# EAGLE board Motherboard Schematics - 1 - 29_Dec_2020 (EAGLE 9.6.2), part 1 of 2
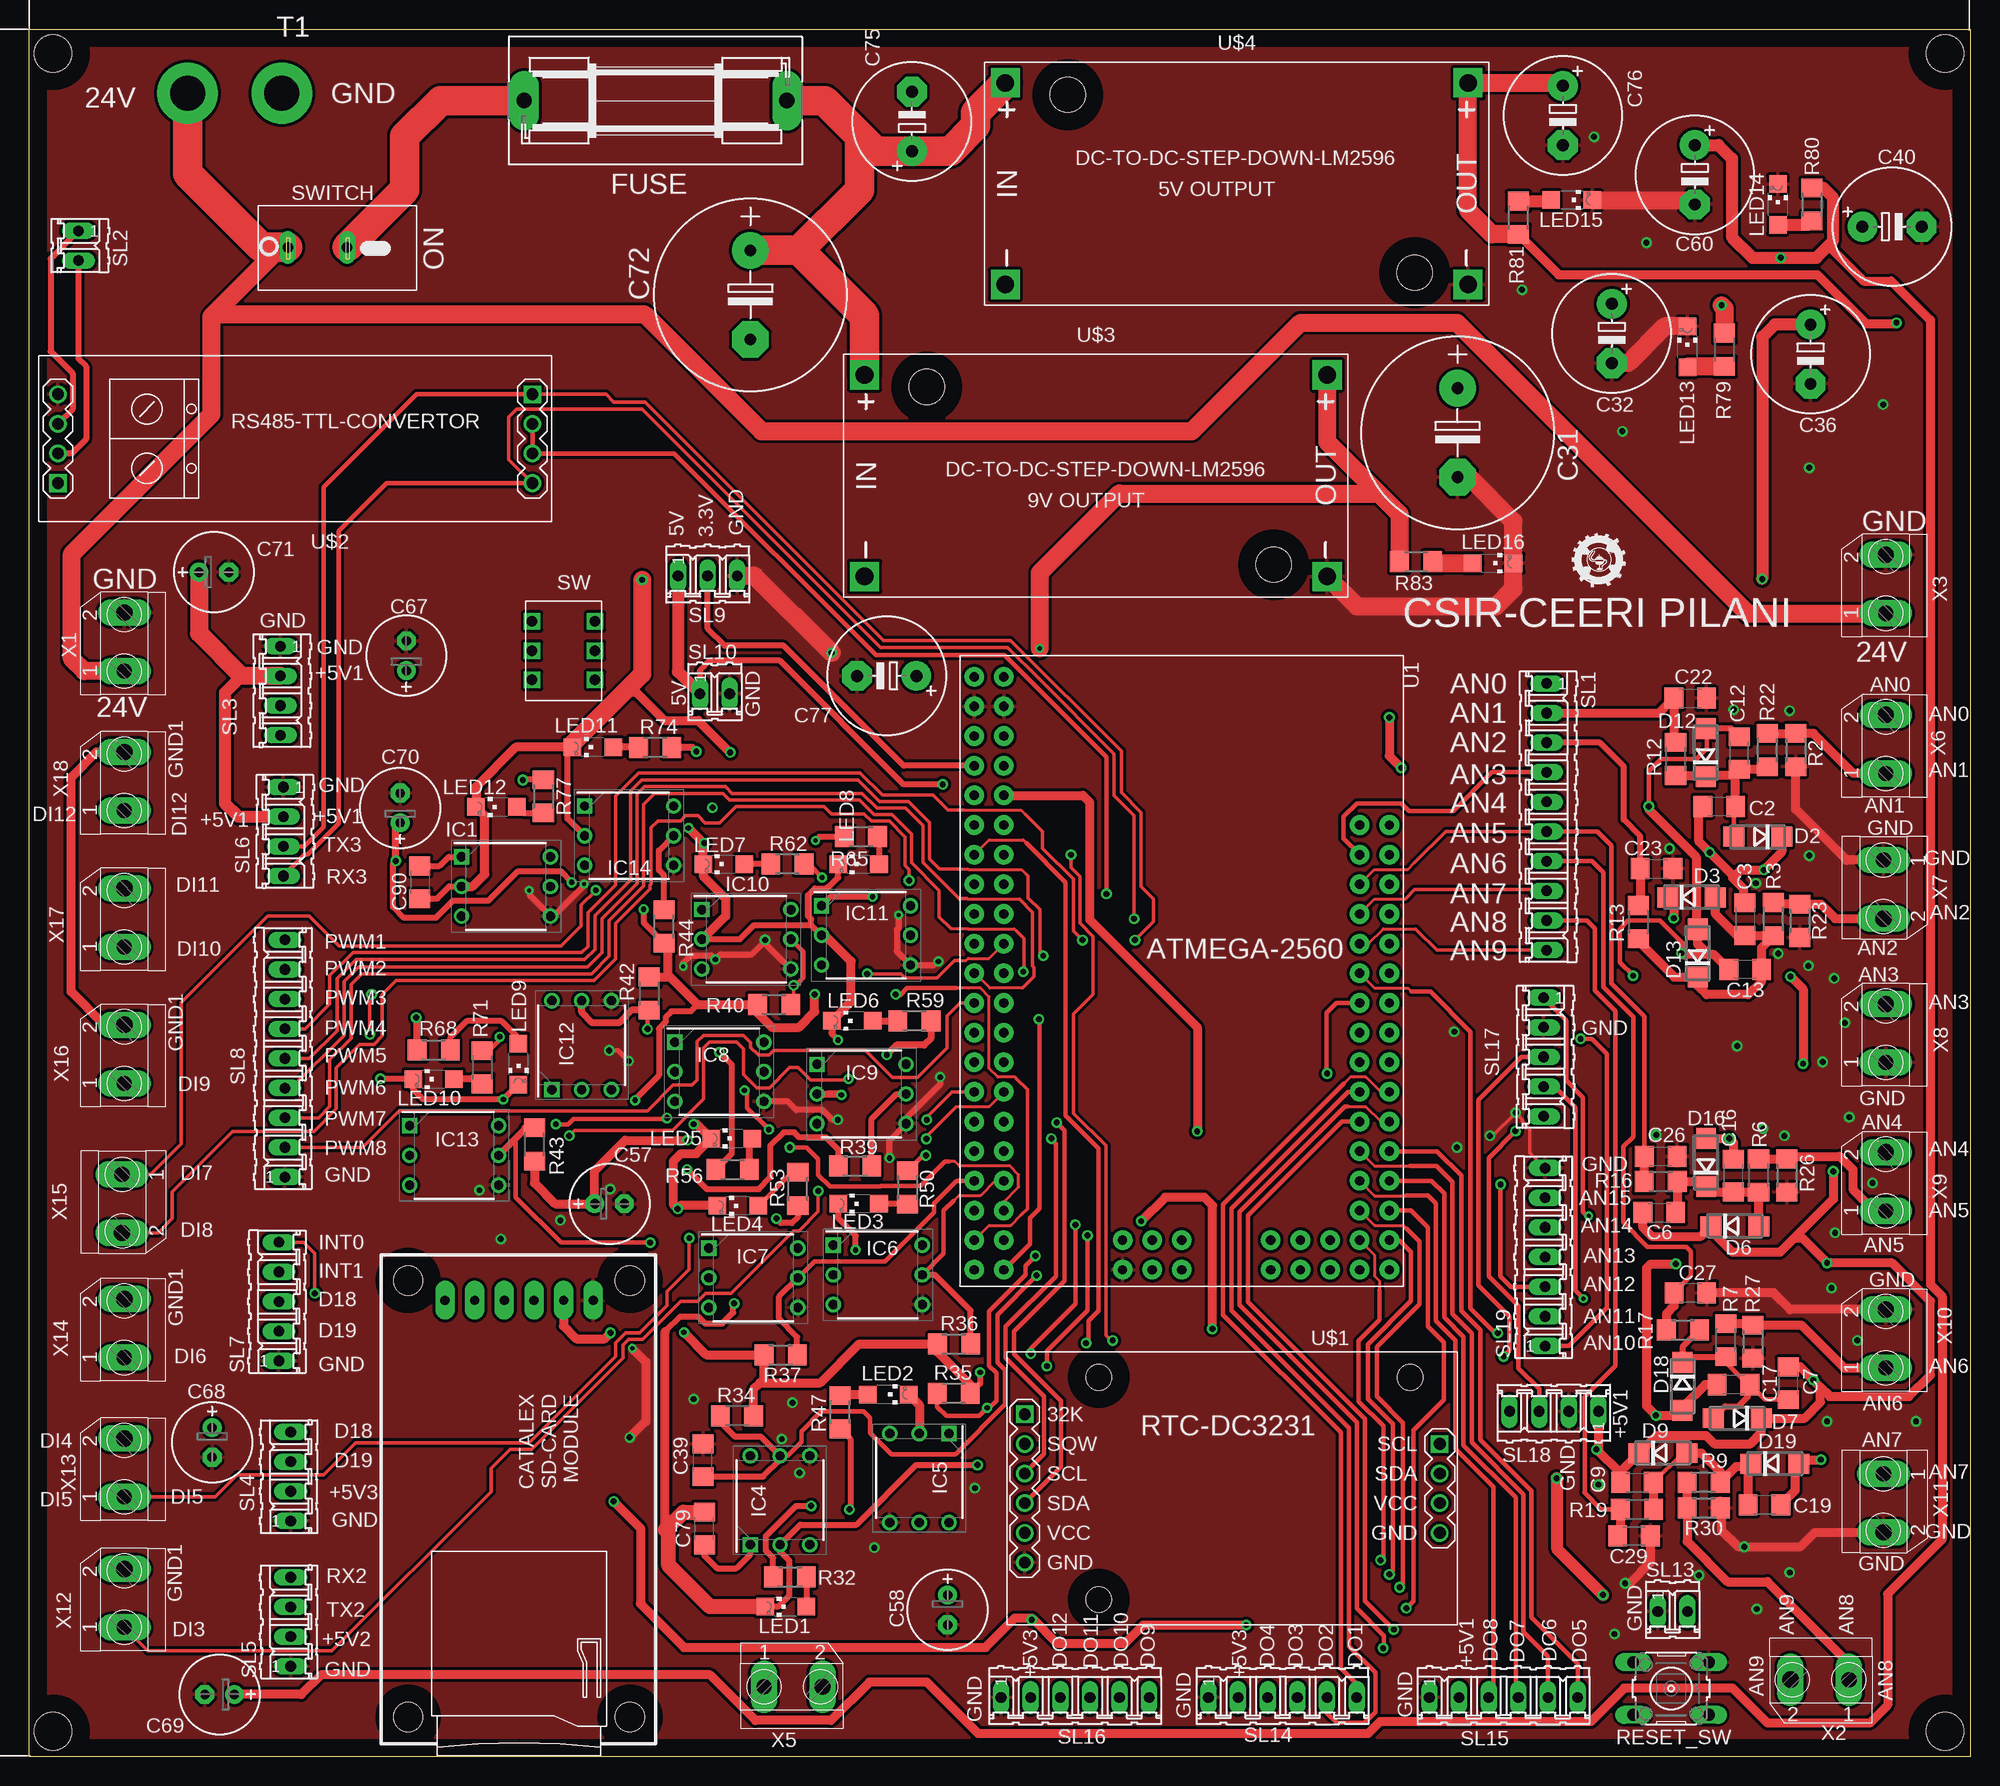
[diagram p3: board, top side]
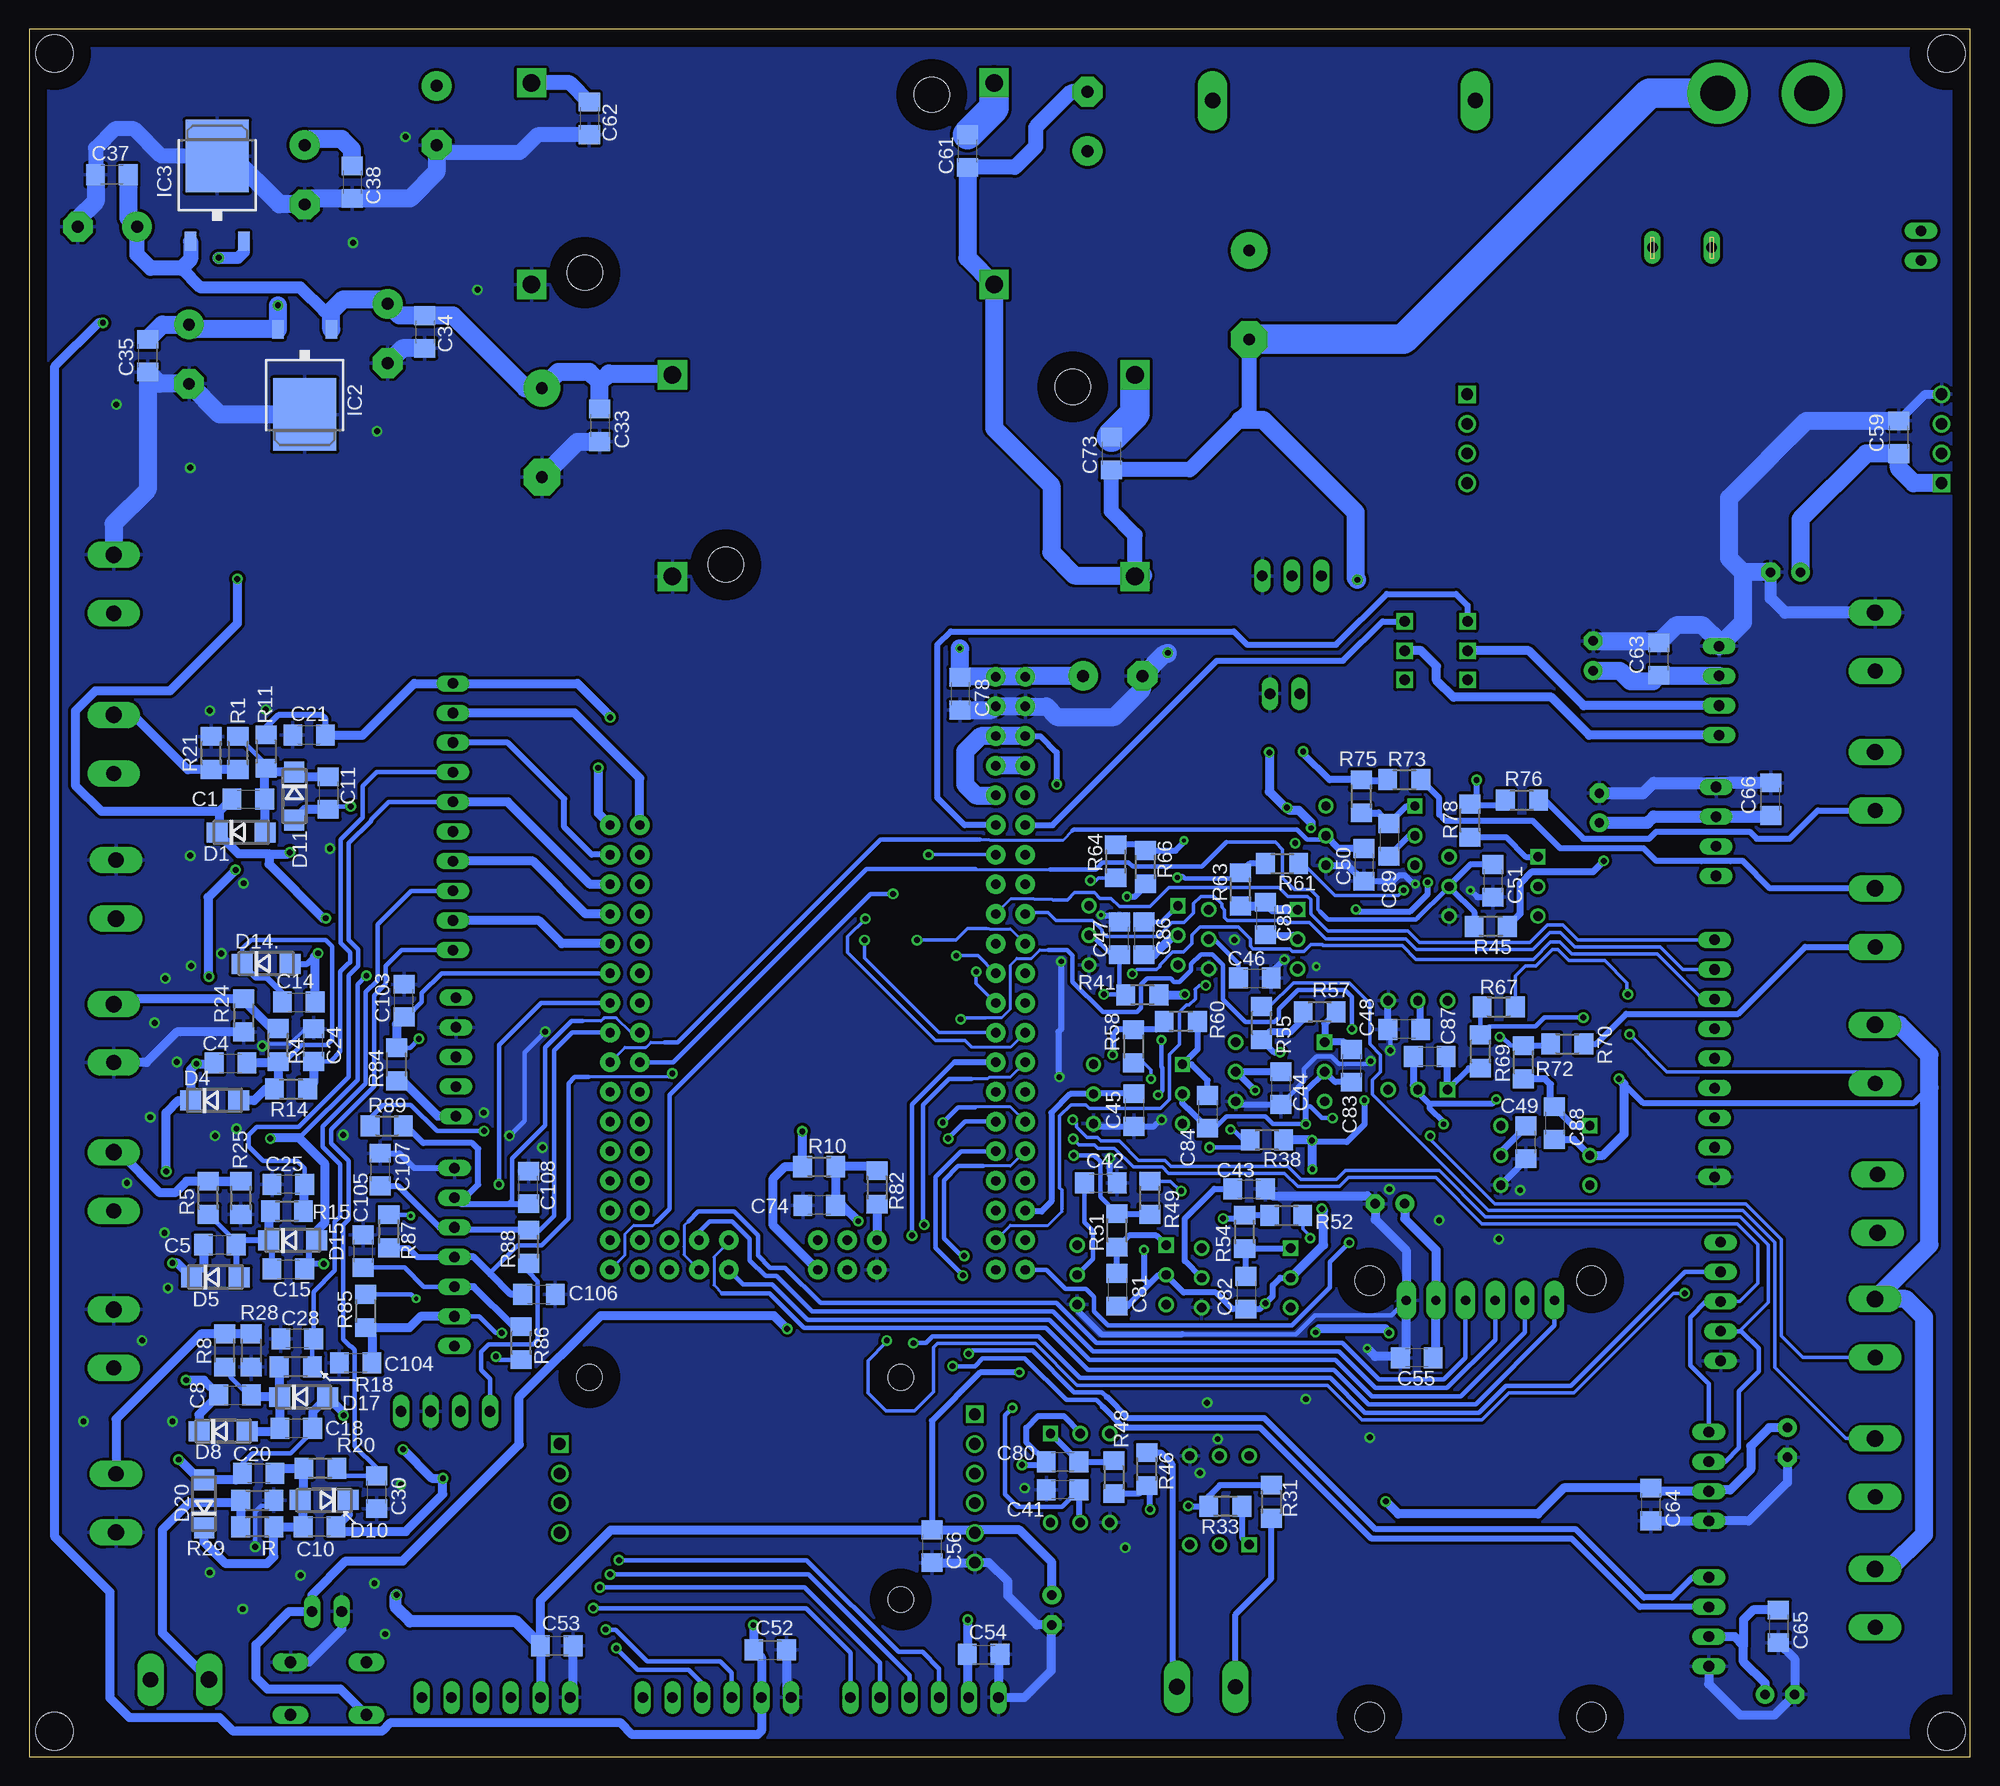
[diagram p4: board, bottom side, seen from below]

Size 166.27 x 147.98 mm. Coordinates in mm from the lower left corner, seen from the top.
Outline: 0,147.98 166.27,147.98 166.27,0 0,0 0,147.98
Copper layers (1*16): Top 0.035mm / dielectric 1.5mm / Bottom 0.035mm
Design rules "default *": minimum track width 6mil, minimum drill 0.35mm, track to track 10mil, track to pad 10mil, pad to pad 10mil, via to via 10mil, smd to smd 10mil, copper to edge 60mil, drill to drill 6mil, minimum pad ring 10mil, minimum via ring 8mil, stop-mask expansion 4mil, vias tented up to drill 22mil, thermal gap 10mil
Holes 3.2 mm at 164.11,145.9 164.11,2.18 2.06,2.18 2.06,145.9

## Footprints (pad centres in the part's own frame; a part is rotated, then mirrored left to right if it is on the bottom)
C1206 = smd 1.6 x 1.8: 1 -1.4,0; 2 1.4,0
E7,5-16 = drill 1.016 pad 3.15: + -3.81,0 | drill 1.016 pad 3.15 octagon: - 3.81,0
E5-10,5 = drill 1.016 pad 2.54: + -2.54,0 | drill 1.016 pad 2.54 octagon: - 2.54,0
E2,5-7 = drill 0.813 pad 1.6: + -1.27,0 | drill 0.813 pad 1.6 octagon: - 1.27,0
DO214AC = smd 1.8 x 1.7: A 2.05,0; C -2.05,0
SH22,5A = drill 1.321 pad 2.54 long: 1 -11.252,0; 2 11.252,0
DIP762W60P254L712H480Q6N = drill 0.8 pad 1.2 square: 1 -3.81,2.54 | drill 0.8 pad 1.2: 2 -3.81,0; 3 -3.81,-2.54; 4 3.81,-2.54; 5 3.81,0; 6 3.81,2.54
TO252 = smd 1 x 1.6: 1 -2.28,-4.8; 2 2.28,-4.8 | smd 5.4 x 6.2: 3 0,2.5
CHIPLED_1206 = smd 1.5 x 1.5: A 0,-1.75; C 0,1.75
CARD-SD-ADAPTER-CATALEX = drill 0.8 pad 1.676 long: CS -17,-6.35; GND -17,6.35; MISO -17,1.27; MOSI -17,-1.27; SCK -17,-3.81; VCC5V -17,3.81 | hole 2.5: -18.7,9.5; 18.7,9.5; 18.7,-9.5; -18.7,-9.5
R1206 = smd 1.6 x 1.803: 1 -1.422,0; 2 1.422,0
B3F-10XX = drill 1.016 long: 1 -3.251,2.261; 2 3.251,2.261; 3 -3.251,-2.261; 4 3.251,-2.261
10P = drill 0.914 long: 1 -11.43,0; 2 -8.89,0; 3 -6.35,0; 4 -3.81,0; 5 -1.27,0; 6 1.27,0; 7 3.81,0; 8 6.35,0; 9 8.89,0; 10 11.43,0
02P = drill 0.914 long: 1 -1.27,0; 2 1.27,0
04P = drill 0.914 long: 1 -3.81,0; 2 -1.27,0; 3 1.27,0; 4 3.81,0
05P = drill 0.914 long: 1 -5.08,0; 2 -2.54,0; 3 0,0; 4 2.54,0; 5 5.08,0
09P = drill 0.914 long: 1 -10.16,0; 2 -7.62,0; 3 -5.08,0; 4 -2.54,0; 5 0,0; 6 2.54,0; 7 5.08,0; 8 7.62,0; 9 10.16,0
03P = drill 0.914 long: 1 -2.54,0; 2 0,0; 3 2.54,0
06P = drill 0.914 long: 1 -6.35,0; 2 -3.81,0; 3 -1.27,0; 4 1.27,0; 5 3.81,0; 6 6.35,0
07P = drill 0.914 long: 1 -7.62,0; 2 -5.08,0; 3 -2.54,0; 4 0,0; 5 2.54,0; 6 5.08,0; 7 7.62,0
SPPH410100 = drill 0.9 square: 1 2.7,-2.5; 2 2.7,0; 3 2.7,2.5; 4 -2.7,-2.5; 5 -2.7,0; 6 -2.7,2.5
SWITCH_I = drill 0.9 long: P$1 5.08,0; P$3 0,0
BOC_TERMINAL = drill 3 pad 5.2: P$1 0,0; P$2 8.08,0
MODULE_MEGA_PRO_EMBED_CH340G_/_ATMEGA2560 = drill 0.8 pad 1.676: 3V3_1 -17.58,-17.78; 3V3_2 -17.58,-15.24; 5V_1 -20.12,-17.78; 5V_2 -20.12,-15.24; 5V_3 25.6,0; A0 -12.5,17.78; A1 -12.5,15.24; A2 -9.96,17.78; A3 -9.96,15.24; A4 -7.42,17.78; A5 -7.42,15.24; A6 -4.88,17.78; A7 -4.88,15.24; A8 -2.34,17.78; A9 -2.34,15.24; A10 0.2,17.78; A11 0.2,15.24; A12 2.74,17.78; A13 2.74,15.24; A14 5.28,17.78; A15 5.28,15.24; AREF -15.04,-15.24; D2 -9.96,-15.24; D3 -9.96,-17.78; D4 -7.42,-15.24; D5 -7.42,-17.78; D6 -4.88,-15.24; D7 -4.88,-17.78; D8 -2.34,-15.24; D9 -2.34,-17.78; D10 0.2,-15.24; D11 0.2,-17.78; D12 2.74,-15.24; D13 2.74,-17.78; D14 5.28,-15.24; D15 5.28,-17.78; D16 7.82,-15.24; D17 7.82,-17.78; D18 10.36,-15.24; D19 10.36,-17.78; D20 12.9,-15.24; D21 12.9,-17.78; D22 15.44,-15.24; D23 15.44,-17.78; D24 17.98,-15.24; D25 17.98,-17.78; D26 20.52,-15.24; D27 20.52,-17.78; D28 23.06,-15.24; D29 23.06,-17.78; D30 25.6,-15.24; D31 25.6,-17.78; D32 7.82,17.78; D33 7.82,15.24; D34 10.36,17.78; D35 10.36,15.24; D36 12.9,17.78; D37 12.9,15.24; D38 15.44,17.78; D39 15.44,15.24; D40 17.98,17.78; D41 17.98,15.24; D42 20.52,17.78; D43 20.52,15.24; D44 23.06,17.78; D45 23.06,15.24; D46 25.6,17.78; D47 25.6,15.24; D48 25.6,12.7; D49 23.06,12.7; D50 25.6,10.16; D51 23.06,10.16; D52 25.6,7.62; D53 23.06,7.62; GND_1 -22.66,-17.78; GND_2 -22.66,-15.24; GND_3 25.6,-5.08; MISO 23.06,0; MOSI 25.6,-2.54; RESET 23.06,-5.08; RST -15.04,-17.78; RX -12.5,-15.24; SCK 23.06,-2.54; TX -12.5,-17.78; VIN_1 -25.2,-17.78; VIN_2 -25.2,-15.24
RTC-DS3231-AT24C32 = drill 1 square: J1.1 -17.78,6.35; J2.1 17.78,3.81 | drill 1: J1.2 -17.78,3.81; J1.3 -17.78,1.27; J1.4 -17.78,-1.27; J1.5 -17.78,-3.81; J1.6 -17.78,-6.35; J2.2 17.78,1.27; J2.3 17.78,-1.27; J2.4 17.78,-3.81 | hole 2.2: -11.43,-9.525; -11.43,9.525; 15.24,9.525
RS485-TTL-CONVERTER = drill 1 square: J1.1 -20.32,-3.81; J2.1 20.32,3.81 | drill 1: J1.2 -20.32,-1.27; J1.3 -20.32,1.27; J1.4 -20.32,3.81; J2.2 20.32,1.27; J2.3 20.32,-1.27; J2.4 20.32,-3.81
DC-DC-STEP-DOWN-LM2596 = drill 1.5 pad 2.5 square: IN+ -19.812,8.636; IN- -19.812,-8.636; OUT+ 19.812,8.636; OUT- 19.812,-8.636 | hole 3: -14.478,7.62; 15.24,-7.62
TERMINAL-BLOCK-2-PIN-3.5MM-LONG-PAD = drill 1.3 pad 2.25 long: 1 -1.75,-0.1 | drill 1.4 pad 2.25 long: 2 3.26,-0.1

## Placement (x,y rotation side)
C1  0.1uF  [C1206]  147.5,82.04 0 bottom
C2  0.1uF  [C1206]  144.75,81.41 0 top
C3  0.1uF  [C1206]  146.96,71.75 270 top
C4  0.1uF  [C1206]  149.02,59.41 0 bottom
C5  0.1uF  [C1206]  149.94,43.87 0 bottom
C6  0.1uF  [C1206]  139.62,46.61 0 top
C7  0.1uF  [C1206]  150.67,32 270 top
C8  0.1uF  [C1206]  148.64,30.99 0 bottom
C9  0.1uF  [C1206]  137.72,23.5 0 top
C10  0.1uF  [C1206]  141.4,19.69 180 bottom
C11  0.1uF  [C1206]  140.64,82.55 270 bottom
C12  0.1uF  [C1206]  146.48,85.98 90 top
C13  0.1uF  [C1206]  146.99,67.44 180 top
C14  0.1uF  [C1206]  143.18,64.64 0 bottom
C15  0.1uF  [C1206]  144.07,41.78 0 bottom
C16  0.1uF  [C1206]  145.97,49.78 90 top
C17  0.1uF  [C1206]  145.97,31.88 180 top
C18  0.1uF  [C1206]  143.38,28.14 0 bottom
C19  0.1uF  [C1206]  148.64,21.59 0 top
C20  0.1uF  [C1206]  146.61,24.26 180 bottom
C21  0.1uF  [C1206]  142.29,87.5 180 bottom
C22  0.1uF  [C1206]  142.27,90.68 0 top
C23  0.1uF  [C1206]  139.4,76.07 0 top
C24  0.1uF  [C1206]  141.91,60.96 90 bottom
C25  0.1uF  [C1206]  144.07,49.02 180 bottom
C26  0.1uF  [C1206]  139.75,51.44 0 top
C27  0.1uF  [C1206]  142.29,39.75 0 top
C28  0.1uF  [C1206]  143.31,35.81 180 bottom
C29  0.1uF  [C1206]  137.46,18.92 0 top
C30  0.1uF  [C1206]  136.53,22.66 270 bottom
C31  1000uF  [E7,5-16]  122.35,113.41 270 top
C32  220uF  [E5-10,5]  135.56,121.92 270 top
C33  0.1uF  [C1206]  117.4,114.05 270 bottom
C34  0.1uF  [C1206]  132.38,122.05 270 bottom
C35  0.1uF  [C1206]  156.13,120.02 270 bottom
C36  220uF  [E5-10,5]  152.58,120.14 270 top
C37  0.1uF  [C1206]  159.18,135.51 180 bottom
C38  0.1uF  [C1206]  138.61,134.87 270 bottom
C39  0.1uF  [C1206]  57.71,25.4 90 top
C40  220uF  [E5-10,5]  159.56,131.06 0 top
C41  0.1uF  [C1206]  77.75,22.86 180 bottom
C42  0.1uF  [C1206]  74.47,49.15 0 bottom
C43  0.1uF  [C1206]  61.77,48.64 0 bottom
C44  0.1uF  [C1206]  59.05,57.28 270 bottom
C45  0.1uF  [C1206]  71.63,55.4 270 bottom
C46  0.1uF  [C1206]  61.29,66.7 0 bottom
C47  0.1uF  [C1206]  72.9,70.1 90 bottom
C48  0.1uF  [C1206]  48.49,62.31 180 bottom
C49  0.1uF  [C1206]  38.07,52.63 270 bottom
C50  0.1uF  [C1206]  51.94,76.4 270 bottom
C51  0.1uF  [C1206]  40.89,75.03 270 bottom
C52  0.1uF  [C1206]  102.79,9.14 0 bottom
C53  0.1uF  [C1206]  121.08,9.53 0 bottom
C54  0.1uF  [C1206]  84.51,8.76 0 bottom
C55  0.1uF  [C1206]  47.42,34.16 180 bottom
C56  0.1uF  [C1206]  88.95,18.03 270 bottom
C57  10uF  [E2,5-7]  49.71,47.37 0 top
C58  10uF  [E2,5-7]  78.66,12.57 270 top
C59  0.1uF  [C1206]  6.12,113.03 90 bottom
C60  220uF  [E5-10,5]  142.67,135.51 270 top
C61  0.1uF  [C1206]  85.9,137.54 270 bottom
C62  0.1uF  [C1206]  118.29,140.34 270 bottom
C63  0.1uF  [C1206]  26.67,94.03 90 bottom
C64  0.1uF  [C1206]  27.38,21.62 270 bottom
C65  0.1uF  [C1206]  16.43,11.18 270 bottom
C66  0.1uF  [C1206]  17.09,82.02 90 bottom
C67  10uF  [E2,5-7]  32.31,94.31 90 top
C68  10uF  [E2,5-7]  15.67,26.92 270 top
C69  10uF  [E2,5-7]  16.31,5.33 180 top
C70  10uF  [E2,5-7]  31.78,81.28 90 top
C71  10uF  [E2,5-7]  15.82,101.47 0 top
C72  1000uF  [E7,5-16]  61.77,125.22 270 top
C73  0.1uF  [C1206]  73.58,111.63 270 bottom
C74  0.1uF  [C1206]  98.6,47.24 180 bottom
C75  220uF  [E5-10,5]  75.62,140.08 90 top
C76  220uF  [E5-10,5]  131.37,140.59 270 top
C77  220uF  [E5-10,5]  73.46,92.58 180 top
C78  0.1uF  [C1206]  86.54,91.06 270 bottom
C79  0.1uF  [C1206]  57.84,19.56 90 top
C80  0.1uF  [C1206]  77.75,25.25 180 bottom
C81  0.1uF  [C1206]  73.08,40.01 270 bottom
C82  0.1uF  [C1206]  62.03,39.75 270 bottom
C83  0.1uF  [C1206]  53.01,59.18 270 bottom
C84  0.1uF  [C1206]  65.33,55.25 270 bottom
C85  0.1uF  [C1206]  60.38,71.81 270 bottom
C86  0.1uF  [C1206]  70.79,70.1 270 bottom
C87  0.1uF  [C1206]  46.3,59.97 180 bottom
C88  0.1uF  [C1206]  35.61,54.28 270 bottom
C89  0.1uF  [C1206]  49.78,78.54 270 bottom
C90  0.1uF  [C1206]  33.45,74.9 270 top
C103  0.1uF  [C1206]  134.16,64.77 90 bottom
C104  0.1uF  [C1206]  138.3,33.73 180 bottom
C105  0.1uF  [C1206]  137.64,43.31 90 bottom
C106  0.1uF  [C1206]  122.61,39.62 0 bottom
C107  0.1uF  [C1206]  136.19,50.29 90 bottom
C108  0.1uF  [C1206]  123.49,48.77 90 bottom
D1  1N4148W  [DO214AC]  148.11,79.17 0 bottom
D2  1N4148W  [DO214AC]  148.06,78.82 180 top
D3  1N4148W  [DO214AC]  142.39,73.61 0 top
D4  1N4148W  [DO214AC]  150.39,56.21 0 bottom
D5  1N4148W  [DO214AC]  150.32,41.07 0 bottom
D6  1N4148W  [DO214AC]  146.1,45.44 0 top
D7  1N4148W  [DO214AC]  146.3,29.01 180 top
D8  1N4148W  [DO214AC]  149.66,27.86 0 bottom
D9  1N4148W  [DO214AC]  139.93,26.01 0 top
D10  1N4148W  [DO214AC]  141,22 180 bottom
D11  1N4148W  [DO214AC]  143.56,82.3 270 bottom
D12  1N4148W  [DO214AC]  143.61,86.03 90 top
D13  1N4148W  [DO214AC]  142.93,68.83 90 top
D14.  1N4148W  [DO214AC]  145.97,67.92 0 bottom
D15  1N4148W  [DO214AC]  143.69,44.22 0 bottom
D16  1N4148W  [DO214AC]  143.64,50.9 90 top
D17  1N4148W  [DO214AC]  142.75,30.81 0 bottom
D18  1N4148W  [DO214AC]  141.61,31.72 270 top
D19  1N4148W  [DO214AC]  149.53,25.1 0 top
D20  1N4148W  [DO214AC]  151.28,21.67 90 bottom
FUSE  [SH22,5A]  53.64,141.86 0 top
IC1  MCT2E  [DIP762W60P254L712H480Q6N]  40.84,74.55 0 top
IC2  7805DT  [TO252]  142.67,117.47 180 bottom
IC3  7805DT  [TO252]  150.16,134.62 0 bottom
IC4  MCT2E  [DIP762W60P254L712H480Q6N]  64.31,21.97 90 top
IC5  MCT2E  [DIP762W60P254L712H480Q6N]  76.25,23.88 270 top
IC6  MCT2E  [DIP762W60P254L712H480Q6N]  72.69,41.28 0 top
IC7  MCT2E  [DIP762W60P254L712H480Q6N]  62.03,41.02 0 top
IC8  MCT2E  [DIP762W60P254L712H480Q6N]  59.11,58.67 0 top
IC9  MCT2E  [DIP762W60P254L712H480Q6N]  71.3,56.77 0 top
IC10  MCT2E  [DIP762W60P254L712H480Q6N]  61.42,70.03 0 top
IC11  MCT2E  [DIP762W60P254L712H480Q6N]  71.68,70.36 0 top
IC12  MCT2E  [DIP762W60P254L712H480Q6N]  47.32,60.96 90 top
IC13  MCT2E  [DIP762W60P254L712H480Q6N]  36.4,51.51 0 top
IC14  MCT2E  [DIP762W60P254L712H480Q6N]  51.38,78.89 0 top
LED1  [CHIPLED_1206]  64.8,12.85 90 top
LED2  [CHIPLED_1206]  73.58,31.04 270 top
LED3  [CHIPLED_1206]  71.04,47.37 90 top
LED4  [CHIPLED_1206]  60.71,47.19 90 top
LED5  [CHIPLED_1206]  60.17,52.96 90 top
LED6  [CHIPLED_1206]  70.51,63.04 90 top
LED7  [CHIPLED_1206]  59.49,76.45 90 top
LED8  [CHIPLED_1206]  71.04,76.45 90 top
LED9  [CHIPLED_1206]  41.91,59.33 180 top
LED10  [CHIPLED_1206]  34.65,58.04 90 top
LED11  [CHIPLED_1206]  48.29,86.49 90 top
LED12  [CHIPLED_1206]  40.03,81.36 90 top
LED13  [CHIPLED_1206]  142.04,120.78 0 top
LED14  [CHIPLED_1206]  149.78,132.97 0 top
LED15  [CHIPLED_1206]  132.13,133.35 270 top
LED16  [CHIPLED_1206]  125.4,102.24 270 top
MOD1  CARD-SD-ADAPTER-CATALEX  [CARD-SD-ADAPTER-CATALEX]  41.96,22.1 270 top
R  1k  [R1206]  146.74,19.69 0 bottom
R1  1k  [R1206]  148.39,85.98 90 bottom
R2  1k  [R1206]  148.89,86.23 270 top
R3  1k  [R1206]  149.4,71.75 270 top
R4  1k  [R1206]  144.93,60.96 270 bottom
R5  1k  [R1206]  150.93,47.88 270 bottom
R6  1k  [R1206]  148.13,49.78 270 top
R7  1k  [R1206]  145.34,35.69 270 top
R8  1k  [R1206]  149.53,34.8 270 bottom
R9  1k  [R1206]  143.43,23.5 0 top
R10  10k  [R1206]  98.6,50.55 180 bottom
R11  1k  [R1206]  145.97,86.11 90 bottom
R12  1k  [R1206]  141.02,85.47 90 top
R13  1k  [R1206]  137.82,71.5 90 top
R14  1k  [R1206]  143.84,57.2 180 bottom
R15  1k  [R1206]  144.2,46.74 180 bottom
R16  1k  [R1206]  139.75,49.28 180 top
R17  1k  [R1206]  141.66,36.58 180 top
R18  1k  [R1206]  143.43,33.4 0 bottom
R19  1k  [R1206]  137.72,21.21 180 top
R20  1k  [R1206]  141.33,24.71 0 bottom
R21  220  [R1206]  150.67,85.98 270 bottom
R22  220  [R1206]  151.31,86.23 90 top
R23  220  [R1206]  151.66,71.6 90 top
R24  220  [R1206]  147.88,63.5 90 bottom
R25  220  [R1206]  148.13,47.88 90 bottom
R26  220  [R1206]  150.55,49.78 90 top
R27  220  [R1206]  147.62,35.56 90 top
R28  220  [R1206]  147.24,34.8 90 bottom
R29  220  [R1206]  146.74,21.97 180 bottom
R30  220  [R1206]  143.43,21.34 180 top
R31  10k  [R1206]  59.87,21.84 90 bottom
R32  2.2k  [R1206]  65.15,15.42 180 top
R33  2.2k  [R1206]  63.8,21.46 0 bottom
R34  3.3k  [R1206]  60.63,29.21 0 top
R35  3.3k  [R1206]  79.2,31.14 0 top
R36  3.3k  [R1206]  79.22,35.36 180 top
R37  3.3k  [R1206]  64.36,34.44 180 top
R38  3.3k  [R1206]  60.25,52.83 0 bottom
R39  3.3k  [R1206]  70.74,50.62 180 top
R40  3.3k  [R1206]  63.8,64.44 180 top
R41  3.3k  [R1206]  70.92,65.25 0 bottom
R42  3.3k  [R1206]  53.11,65.38 90 top
R43  3.3k  [R1206]  43.28,52.45 270 top
R44  3.3k  [R1206]  54.38,71.12 270 top
R45  3.3k  [R1206]  41.07,71.12 0 bottom
R46  10k  [R1206]  70.54,24.64 270 bottom
R47  2.2k  [R1206]  69.47,29.51 270 top
R48  2.2k  [R1206]  73.36,23.95 90 bottom
R49  10k  [R1206]  70.28,47.88 270 bottom
R50  2.2k  [R1206]  75.23,48.77 90 top
R51  2.2k  [R1206]  73.08,45.09 270 bottom
R52  10k  [R1206]  58.6,46.36 180 bottom
R53  2.2k  [R1206]  65.84,48.64 270 top
R54  2.2k  [R1206]  62.15,44.96 270 bottom
R55  10k  [R1206]  60.71,62.84 270 bottom
R56  2.2k  [R1206]  60.25,50.29 180 top
R57  2.2k  [R1206]  55.73,63.78 0 bottom
R58  10k  [R1206]  71.68,60.86 90 bottom
R59  2.2k  [R1206]  75.82,63.04 0 top
R60  2.2k  [R1206]  67.61,62.99 0 bottom
R61  10k  [R1206]  58.95,76.5 180 bottom
R62  2.2k  [R1206]  64.95,76.45 0 top
R63  2.2k  [R1206]  62.53,74.3 270 bottom
R64  10k  [R1206]  73.2,76.71 90 bottom
R65  2.2k  [R1206]  71.25,78.82 180 top
R66  2.2k  [R1206]  70.66,76.2 270 bottom
R67  10k  [R1206]  40.39,64.24 180 bottom
R68  2.2k  [R1206]  34.65,60.55 180 top
R69  2.2k  [R1206]  41.96,60.4 270 bottom
R70  10k  [R1206]  34.52,61.06 180 bottom
R71  2.2k  [R1206]  38.81,59.06 90 top
R72  2.2k  [R1206]  38.28,59.49 270 bottom
R73  10k  [R1206]  48.49,83.69 180 bottom
R74  2.2k  [R1206]  53.62,86.46 0 top
R75  2.2k  [R1206]  52.17,82.27 270 bottom
R76  10k  [R1206]  38.4,81.94 180 bottom
R77  2.2k  [R1206]  44.04,82.27 90 top
R78  2.2k  [R1206]  42.85,80.19 270 bottom
R79  1k  [R1206]  145.21,120.52 90 top
R80  1k  [R1206]  152.7,132.97 90 top
R81  1k  [R1206]  127.56,131.83 270 top
R82  1k  [R1206]  93.65,48.77 90 bottom
R83  1k  [R1206]  118.8,102.36 180 top
R84  1k  [R1206]  134.8,59.31 270 bottom
R85  1k  [R1206]  137.46,38.18 90 bottom
R86  1k  [R1206]  124.13,35.43 270 bottom
R87  1k  [R1206]  135.46,45.01 90 bottom
R88  1k  [R1206]  123.49,43.69 270 bottom
R89  1k  [R1206]  135.64,54.05 180 bottom
RESET_SW  [B3F-10XX]  140.64,5.84 180 top
SL1  [10P]  129.97,80.52 270 top
SL2  [02P]  4.22,129.44 270 top
SL3  [04P]  21.51,91.31 270 top
SL4  [04P]  22.4,24 90 top
SL5  [04P]  22.4,11.56 90 top
SL6  [04P]  21.77,79.25 270 top
SL7  [05P]  21.39,38.99 90 top
SL8  [09P]  21.89,59.82 90 top
SL9  [03P]  58.12,101.14 0 top
SL10  [02P]  58.72,91.06 0 top
SL13  [02P]  140.77,12.45 0 top
SL14  [06P]  107.37,5.08 0 top
SL15  [06P]  126.29,5.08 0 top
SL16  [06P]  89.59,5.08 0 top
SL17  [05P]  129.72,59.94 270 top
SL18  [04P]  130.61,29.59 180 top
SL19  [07P]  129.84,42.8 90 top
SW  SPPH410100  [SPPH410100]  45.77,94.74 0 top
SWITCH  SWITCH_I  [SWITCH_I]  22.15,129.29 0 top
T1  TERMINAL_BLOCK  [BOC_TERMINAL]  21.64,142.49 180 top
U1  MEGA_PRO_EMBED_CH340G_/_ATMEGA2560  [MODULE_MEGA_PRO_EMBED_CH340G_/_ATMEGA2560]  98.73,67.31 270 top
U$1  RTC-DS3231-AT24C32  [RTC-DS3231-AT24C32]  103.05,22.99 0 top
U$2  RS485-TTL-CONVERTER  [RS485-TTL-CONVERTER]  22.78,112.9 180 top
U$3  DC-DC-STEP-DOWN-LM2596  [DC-DC-STEP-DOWN-LM2596]  91.36,109.73 0 top
U$4  DC-DC-STEP-DOWN-LM2596  [DC-DC-STEP-DOWN-LM2596]  103.43,134.75 0 top
U$5  CSIR_LOGO  [CSIR_LOGO]  134.57,102.41 0 top
X1  5mmTerminal_Block  [TERMINAL-BLOCK-2-PIN-3.5MM-LONG-PAD]  8.05,94.74 90 top
X2  5mmTerminal_Block  [TERMINAL-BLOCK-2-PIN-3.5MM-LONG-PAD]  154.13,6.5 180 top
X3  5mmTerminal_Block  [TERMINAL-BLOCK-2-PIN-3.5MM-LONG-PAD]  158.93,99.69 90 top
X5  TERMINAL-BLOCK-3.5MM-2-PIN-LONG-PAD  [TERMINAL-BLOCK-2-PIN-3.5MM-LONG-PAD]  64.69,6.1 0 top
X6  5mmTerminal_Block  [TERMINAL-BLOCK-2-PIN-3.5MM-LONG-PAD]  158.93,85.98 90 top
X7  5mmTerminal_Block  [TERMINAL-BLOCK-2-PIN-3.5MM-LONG-PAD]  158.93,75.06 270 top
X8  5mmTerminal_Block  [TERMINAL-BLOCK-2-PIN-3.5MM-LONG-PAD]  158.93,61.21 90 top
X9  5mmTerminal_Block  [TERMINAL-BLOCK-2-PIN-3.5MM-LONG-PAD]  158.93,48.51 90 top
X10  5mmTerminal_Block  [TERMINAL-BLOCK-2-PIN-3.5MM-LONG-PAD]  158.93,35.05 90 top
X11  5mmTerminal_Block  [TERMINAL-BLOCK-2-PIN-3.5MM-LONG-PAD]  158.93,22.48 270 top
X12  TERMINAL-BLOCK-3.5MM-2-PIN-LONG-PAD  [TERMINAL-BLOCK-2-PIN-3.5MM-LONG-PAD]  8.05,12.83 90 top
X13  TERMINAL-BLOCK-3.5MM-2-PIN-LONG-PAD  [TERMINAL-BLOCK-2-PIN-3.5MM-LONG-PAD]  8.05,24 90 top
X14  TERMINAL-BLOCK-3.5MM-2-PIN-LONG-PAD  [TERMINAL-BLOCK-2-PIN-3.5MM-LONG-PAD]  8.05,35.94 90 top
X15  TERMINAL-BLOCK-3.5MM-2-PIN-LONG-PAD  [TERMINAL-BLOCK-2-PIN-3.5MM-LONG-PAD]  8.05,48.13 270 top
X16  TERMINAL-BLOCK-3.5MM-2-PIN-LONG-PAD  [TERMINAL-BLOCK-2-PIN-3.5MM-LONG-PAD]  8.05,59.44 90 top
X17  TERMINAL-BLOCK-3.5MM-2-PIN-LONG-PAD  [TERMINAL-BLOCK-2-PIN-3.5MM-LONG-PAD]  8.05,71.12 90 top
X18  TERMINAL-BLOCK-3.5MM-2-PIN-LONG-PAD  [TERMINAL-BLOCK-2-PIN-3.5MM-LONG-PAD]  8.05,82.8 90 top